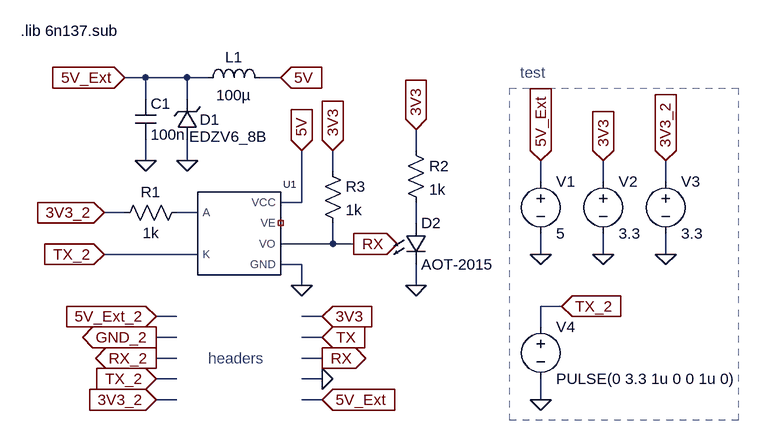
[diagram p0: schematic pcb.asc]
pcb.asc, the LTspice schematic file:
Version 4
SHEET 1 992 680
WIRE 48 -64 16 -64
WIRE 112 -64 48 -64
WIRE 144 -64 112 -64
WIRE 256 -64 224 -64
WIRE 48 -32 48 -64
WIRE 112 -32 112 -64
WIRE 464 48 464 16
WIRE 48 64 48 32
WIRE 112 64 112 32
WIRE 336 80 336 48
WIRE 656 96 656 64
WIRE 752 96 752 64
WIRE 848 96 848 64
WIRE 288 128 288 48
WIRE 288 128 256 128
WIRE 16 144 -16 144
WIRE 128 144 96 144
WIRE 464 160 464 128
WIRE 336 192 336 160
WIRE 336 192 256 192
WIRE 368 192 336 192
WIRE 128 208 -16 208
WIRE 656 208 656 176
WIRE 752 208 752 176
WIRE 848 208 848 176
WIRE 288 224 256 224
WIRE 288 256 288 224
WIRE 464 256 464 224
WIRE 688 288 656 288
WIRE 96 304 64 304
WIRE 320 304 288 304
WIRE 656 320 656 288
WIRE 96 336 64 336
WIRE 320 336 288 336
WIRE 96 368 64 368
WIRE 320 368 288 368
WIRE 96 400 64 400
WIRE 320 400 288 400
WIRE 96 432 64 432
WIRE 320 432 288 432
WIRE 656 432 656 400
FLAG 48 64 0
FLAG 112 64 0
FLAG 752 208 0
FLAG 752 64 3V3
IOPIN 752 64 In
FLAG 16 -64 5V_Ext
IOPIN 16 -64 In
FLAG -16 144 3V3_2
IOPIN -16 144 In
FLAG -16 208 TX_2
IOPIN -16 208 In
FLAG 288 48 5V
IOPIN 288 48 In
FLAG 288 256 0
FLAG 656 208 0
FLAG 368 192 RX
IOPIN 368 192 Out
FLAG 464 256 0
FLAG 336 48 3V3
IOPIN 336 48 In
FLAG 256 -64 5V
IOPIN 256 -64 In
FLAG 464 16 3V3
IOPIN 464 16 In
FLAG 320 432 5V_Ext
IOPIN 320 432 In
FLAG 320 400 0
FLAG 320 368 RX
IOPIN 320 368 Out
FLAG 320 336 TX
IOPIN 320 336 In
FLAG 320 304 3V3
IOPIN 320 304 In
FLAG 64 304 5V_Ext_2
IOPIN 64 304 In
FLAG 64 368 RX_2
IOPIN 64 368 Out
FLAG 64 400 TX_2
IOPIN 64 400 In
FLAG 64 432 3V3_2
IOPIN 64 432 In
FLAG 64 336 GND_2
IOPIN 64 336 Out
FLAG 848 208 0
FLAG 848 64 3V3_2
IOPIN 848 64 In
FLAG 688 288 TX_2
IOPIN 688 288 In
FLAG 656 432 0
FLAG 656 64 5V_Ext
IOPIN 656 64 In
SYMBOL 6n137 192 176 R0
SYMATTR InstName U1
SYMBOL cap 32 -32 R0
SYMATTR InstName C1
SYMATTR Value 100n
SYMBOL voltage 752 80 R0
WINDOW 123 0 0 Left 2
WINDOW 39 0 0 Left 2
SYMATTR InstName V2
SYMATTR Value 3.3
SYMBOL res 112 128 R90
WINDOW 0 0 56 VBottom 2
WINDOW 3 32 56 VTop 2
SYMATTR InstName R1
SYMATTR Value 1k
SYMBOL zener 128 32 R180
WINDOW 0 -34 31 Left 2
WINDOW 3 -107 5 Left 2
SYMATTR InstName D1
SYMATTR Value EDZV6_8B
SYMATTR Description Diode
SYMATTR Type diode
SYMBOL LED 448 160 R0
SYMATTR InstName D2
SYMATTR Value AOT-2015
SYMATTR Description Diode
SYMATTR Type diode
SYMBOL res 448 32 R0
SYMATTR InstName R2
SYMATTR Value 1k
SYMBOL res 320 64 R0
SYMATTR InstName R3
SYMATTR Value 1k
SYMBOL ind 128 -48 R270
WINDOW 0 32 56 VTop 2
WINDOW 3 5 56 VBottom 2
SYMATTR InstName L1
SYMATTR Value 100µ
SYMBOL voltage 848 80 R0
WINDOW 123 0 0 Left 2
WINDOW 39 0 0 Left 2
SYMATTR InstName V3
SYMATTR Value 3.3
SYMBOL voltage 656 304 R0
WINDOW 123 0 0 Left 2
WINDOW 39 0 0 Left 2
SYMATTR InstName V4
SYMATTR Value PULSE(0 3.3 1u 0 0 1u 0)
SYMBOL voltage 656 80 R0
WINDOW 123 0 0 Left 2
WINDOW 39 0 0 Left 2
SYMATTR InstName V1
SYMATTR Value 5
TEXT 144 368 Left 2 ;headers
TEXT -144 -136 Left 2 !.lib 6n137.sub
TEXT 624 -72 Left 2 ;test
RECTANGLE Normal 960 464 608 -48 2

The netlist it stands for:
* pcb.asc
XU1 N001 TX_2 0 RX NC_01 5V 6N137  ; pins A K GND VO VE VCC
C1 5V_Ext 0 100n
V2 3V3 0 3.3
R1 N001 3V3_2 1k
D1 0 5V_Ext EDZV6_8B
D2 N002 0 AOT-2015
R2 3V3 N002 1k
R3 3V3 RX 1k
L1 5V_Ext 5V 100µ
V3 3V3_2 0 3.3
V4 TX_2 0 PULSE(0 3.3 1u 0 0 1u 0)
V1 5V_Ext 0 5
.model D D
.lib standard.dio
* headers
.lib 6n137.sub
* test
.backanno
.end